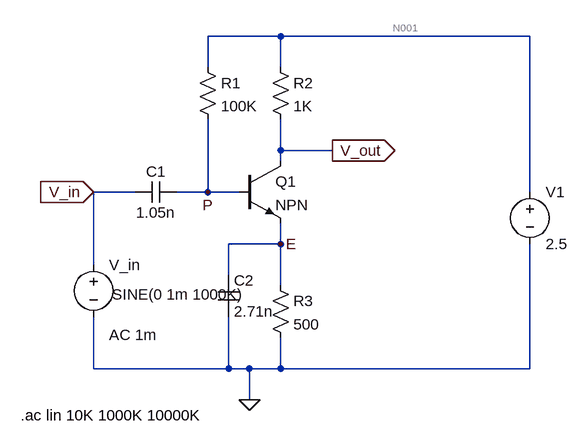
[diagram p0: schematic 1.asc]
1.asc, the LTspice schematic file:
Version 4
SHEET 1 880 680
WIRE 288 -112 176 -112
WIRE 672 -112 288 -112
WIRE 176 -64 176 -112
WIRE 288 -64 288 -112
WIRE 288 64 288 16
WIRE 368 64 288 64
WIRE 288 80 288 64
WIRE 64 128 0 128
WIRE 176 128 176 16
WIRE 176 128 128 128
WIRE 224 128 176 128
WIRE 672 128 672 -112
WIRE 288 208 288 176
WIRE 288 208 208 208
WIRE 0 240 0 128
WIRE 208 256 208 208
WIRE 288 272 288 208
WIRE 0 400 0 320
WIRE 208 400 208 320
WIRE 208 400 0 400
WIRE 240 400 208 400
WIRE 288 400 288 352
WIRE 288 400 240 400
WIRE 672 400 672 208
WIRE 672 400 288 400
WIRE 240 448 240 400
FLAG 240 448 0
FLAG 368 64 V_out
IOPIN 368 64 Out
FLAG 0 128 V_in
IOPIN 0 128 In
FLAG 176 128 P
FLAG 288 208 E
SYMBOL cap 128 112 R90
WINDOW 0 0 32 VBottom 2
WINDOW 3 32 32 VTop 2
SYMATTR InstName C1
SYMATTR Value 1.05n
SYMBOL res 160 -80 R0
SYMATTR InstName R1
SYMATTR Value 100K
SYMBOL res 272 -80 R0
SYMATTR InstName R2
SYMATTR Value 1K
SYMBOL npn 224 80 R0
SYMATTR InstName Q1
SYMBOL res 272 256 R0
SYMATTR InstName R3
SYMATTR Value 500
SYMBOL voltage 672 112 R0
WINDOW 123 0 0 Left 0
WINDOW 39 0 0 Left 0
SYMATTR InstName V1
SYMATTR Value 2.5
SYMBOL voltage 0 224 R0
WINDOW 3 130 62 Center 2
WINDOW 123 24 124 Left 2
WINDOW 39 0 0 Left 0
SYMATTR Value SINE(0 1m 1000K)
SYMATTR Value2 AC 1m
SYMATTR InstName V_in
SYMBOL cap 192 256 R0
SYMATTR InstName C2
SYMATTR Value 2.71n
TEXT -112 472 Left 2 !.ac lin 10K 1000K 10000K

The netlist it stands for:
* 1.asc
C1 P V_in 1.05n
R1 N001 P 100K
R2 N001 V_out 1K
Q1 V_out P E 0 NPN
R3 E 0 500
V1 N001 0 2.5
V_in V_in 0 SINE(0 1m 1000K) AC 1m
C2 E 0 2.71n
.model NPN NPN
.model PNP PNP
.lib standard.bjt
.ac lin 10K 1000K 10000K
.backanno
.end

* Results of the author's LTspice run, read from the files saved beside the schematic
* Operating Point, zero values left out:
*   V(p) = 1.356 V
*   V(n001) = 2.5 V
*   V(v_out) = 1.356 V
*   V(e) = 577.9 mV
*   Ic(Q1) = 1.144 mA
*   Ib(Q1) = 11.44 µA
*   Ie(Q1) = -1.156 mA
*   I(R3) = 1.156 mA
*   I(R2) = 1.144 mA
*   I(R1) = 11.44 µA
*   I(V1) = -1.156 mA
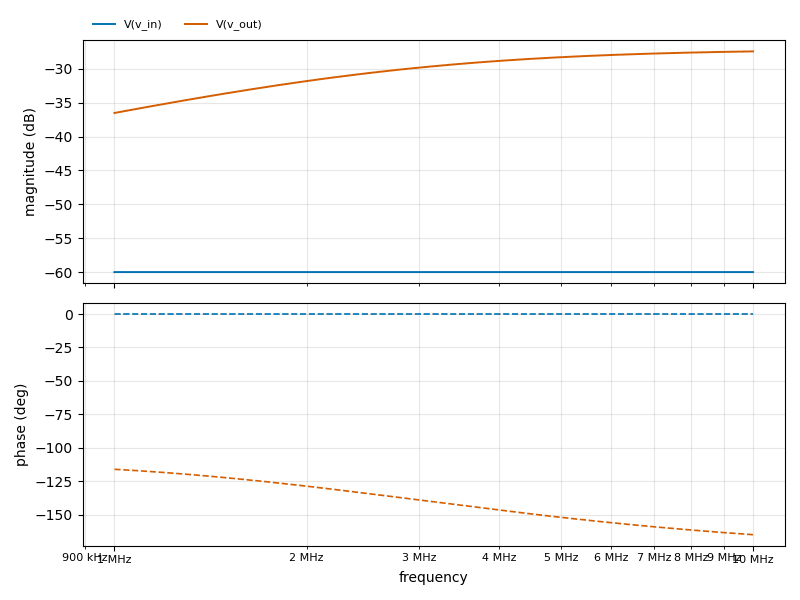
[diagram p1: AC Analysis of 1.asc, plotted from the saved traces]
* AC Analysis, 1 run:
*   V(v_in): -60.00 dB at 1 MHz, -60.00 dB at 10 MHz, peak -60.00 dB at 1 MHz
*   V(v_out): -36.50 dB at 1 MHz, -27.41 dB at 10 MHz, peak -27.41 dB at 10 MHz, 3 dB below the peak at 2.604 MHz